# Altium project LM2596_DC-DC.PrjPcb
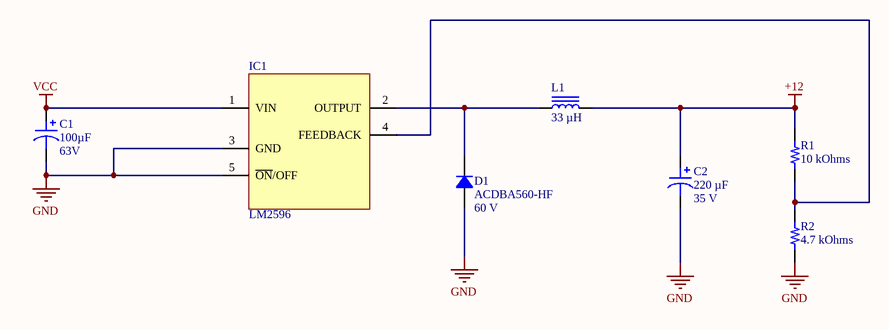
[diagram p0: LM2596SCH.SchDoc]
1 sheet, 7 parts. Net scope: global (net labels, ports and power ports of the same name join across sheets).
Board file: lm2596.PcbDoc

## Sheet LM2596SCH.SchDoc
size A2; SheetNumber: 1; SheetTotal: 1

### Parts
C1  100µF  Voltage - Rated: 63V  [CAP TH ALUM ELEC D8.00mm S3.50mm H12.50mm]
C2  220 µF  Voltage - Rated: 35 V  [CAP AL TH D8 L3.5 H12.5]
D1  ACDBA560-HF  Voltage - DC Reverse (Vr) (Max): 60 V  [DO214AC SMA]
IC1  LM2596  [LM2596]
L1  33 µH  [BOURNS SRR1280]
R1  10 kOhms  [RES 0805_2012]
R2  4.7 kOhms  [RES 0805_2012]

### Nets
+12: C2.1 L1.2 R1.2
GND: C1.2 C2.2 D1.1 IC1.3(GND) IC1.5(~{ON}/OFF) R2.1
VCC: C1.1 IC1.1(VIN)
NetD1_2: D1.2 IC1.2(OUTPUT) L1.1
NetIC1_4: IC1.4(FEEDBACK) R1.1 R2.2

### Library data of the parts
C1 = ECA-1JM101: CAP ALUM 100UF 20% 63V RADIAL; manufacturer: Panasonic Electronic Components; Lifetime @ Temp.: 2000 Hrs @ 85°C; Polarization: Polar; Ripple Current @ High Frequency: 459mA @ 10kHz; Ripple Current @ Low Frequency: 270mA @ 120Hz; Part Number: ECA-1JM101; Applications: General Purpose; Capacitance: 100µF; componentlink1description: Datasheet; componentlink1url: //media.digikey.com/pdf/Data%20Sheets/Panasonic%20Electronic%20Components/ECA-xxM%20Series,TypeA.pdf; componentlink2description: DigiKey Link; componentlink2url: http://digikey.com/product-detail/en/panasonic-electronic-components/ECA-1JM101/P5193-ND/245052; Device Package: Radial, Can; Height - Seated (Max): 0.492" (12.50mm); lastupdated: 7.09.2020 05:24:51; Lead Spacing: 0.138" (3.50mm); Lifecycle Status: Active; Minimum Order: 1; Mounting Type: Through Hole; Operating Temperature: -40°C ~ 85°C; Package / Case: Radial, Can; packaging: Bulk; partid: 7225; Part Status: Active; price: 0.37; series: M; Size / Dimension: 0.315" Dia (8.00mm); Supplier 1: DigiKey; Supplier Part Number 1: P5193-ND; Tolerance: ±20%; value: 100µF
C2 = ECA-1VM221: CAP ALUM 220UF 20% 35V RADIAL; manufacturer: Panasonic Electronic Components; Lifetime @ Temp.: 2000 Hrs @ 85°C; Polarization: Polar; Ripple Current @ High Frequency: 595 mA @ 10 kHz; Ripple Current @ Low Frequency: 350 mA @ 120 Hz; Part Number: ECA-1VM221; Applications: General Purpose; Capacitance: 220 µF; componentlink1description: Datasheet; componentlink1url: //media.digikey.com/pdf/Data%20Sheets/Panasonic%20Electronic%20Components/ECA-xxM%20Series,TypeA.pdf; componentlink2description: DigiKey Link; componentlink2url: https://www.digikey.com/en/products/detail/panasonic-electronic-components/ECA-1VM221/245025; Device Package: Radial, Can; Height - Seated (Max): 0.492" (12.50mm); lastupdated: 23.05.2022 13:42:17; Lead Spacing: 0.138" (3.50mm); Lifecycle Status: Active; Minimum Order: 1; Mounting Type: Through Hole; Operating Temperature: -40°C ~ 85°C; Package / Case: Radial, Can; packaging: Bulk; partid: 7280; Part Status: Active; price: 0.10; series: M-A; Size / Dimension: 0.315" Dia (8.00mm); Supplier 1: DigiKey; Supplier Part Number 1: P5166-ND; Tolerance: ±20%; value: 220 µF
D1 = ACDBA560-HF: DIODE SCHOTTKY 60V 5A DO214AC; Manufacturer: Comchip Technology; Capacitance @ Vr, F: 250pF @ 4V, 1MHz; Current - Average Rectified (Io): 5A (DC); Current - Reverse Leakage @ Vr: 500 µA @ 60 V; Speed: Fast Recovery =< 500ns, > 200mA (Io); Voltage - Forward (Vf) (Max) @ If: 700 mV @ 5 A; Part Number: ACDBA560-HF; ComponentLink1Description: Datasheet; ComponentLink1URL: http://www.comchiptech.com/admin/files/product/ACDBA560-HF%20RevA201382.pdf; ComponentLink2Description: DigiKey Link; ComponentLink2URL: https://www.digikey.com/en/products/detail/comchip-technology/ACDBA560-HF/7100903; Diode Type: Schottky; LastUpdated: 23.05.2022 13:36:13; Lifecycle Status: Active; Minimum Order: 1; Mounting Type: Surface Mount; Operating Temperature - Junction: -55°C ~ 125°C; Package / Case: DO-214AC, SMA; Packaging: TapeAndReel; PartId: 1832; Part Status: Active; Price: 0.15; Series: Automotive, AEC-Q101; Supplier 1: DigiKey; Supplier Part Number 1: 641-2078-1-ND; Supplier Device Package: DO-214AC (SMA)
L1 = SRR1280-330M: FIXED IND 33UH 3.5A 57 MOHM SMD; Manufacturer: Bourns Inc.; Current - Saturation: 3.3A; DC Resistance (DCR): 57mOhm Max; Frequency - Self Resonant: 9.5MHz; Inductance Frequency - Test: 100 kHz; Material - Core: Ferrite; Q @ Freq: 28 @ 2.52MHz; Shielding: Shielded; Tolerance: ±20%; Type: Wirewound; Part Number: SRR1280-330M; ComponentLink1Description: Datasheet; ComponentLink1URL: https://www.bourns.com/docs/Product-Datasheets/SRR1280.pdf; ComponentLink2Description: DigiKey Link; ComponentLink2URL: https://www.digikey.com/en/products/detail/bourns-inc/SRR1280-330M/1969998; Current Rating (Amps): 3.5 A; Device Package: Nonstandard; Height - Seated (Max): 0.315" (8.00mm); Inductance: 33 µH; LastUpdated: 23.05.2022 13:40:12; Lifecycle Status: Active; Minimum Order: 1; Mounting Type: Surface Mount; Operating Temperature: -40°C ~ 125°C; Package / Case: Nonstandard; Packaging: TapeAndReel; PartId: 25; Part Status: Active; Price: 0.82; Series: SRR1280; Size / Dimension: 0.492" L x 0.492" W (12.50mm x 12.50mm); Supplier 1: DigiKey; Supplier Part Number 1: SRR1280-330MCT-ND; Value: 33 µH
R1 = RNCS0805BKE10K0: RES 10K OHM 0.1% 1/10W 0805; Manufacturer: Stackpole Electronics Inc; Power (Watts): 0.1W, 1/10W; Temperature Coefficient: ±25ppm/°C; Part Number: RNCS0805BKE10K0; Value: 10 kOhms; ComponentLink1Description: Datasheet; ComponentLink1URL: https://www.seielect.com/catalog/sei-rncs_rnch.pdf; ComponentLink2Description: DigiKey Link; ComponentLink2URL: https://www.digikey.com/en/products/detail/stackpole-electronics-inc/RNCS0805BKE10K0/1800067; Composition: Thin Film; Device Package: 0805 (2012 Metric); Features: Anti-Corrosive, Automotive AEC-Q200, Moisture Resistant; Height - Seated (Max): 0.026" (0.65mm); LastUpdated: 23.05.2022 13:28:13; Lifecycle Status: Active; Minimum Order: 1; Number of Terminations: 2; Operating Temperature: -55°C ~ 155°C; Package / Case: 0805 (2012 Metric); Packaging: TapeAndReel; PartId: 27713; Part Status: Active; Price: 0.09; Ratings: AEC-Q200; Resistance: 10 kOhms; Series: RNCS; Size / Dimension: 0.079" L x 0.049" W (2.00mm x 1.25mm); Supplier 1: DigiKey; Supplier Part Number 1: RNCS0805BKE10K0CT-ND; Supplier Device Package: 0805; Tolerance: ±0.1%
R2 = CRGP0805F4K7: RES 4.7K OHM 1% 1/3W 0805; Manufacturer: TE Connectivity Passive Product; Power (Watts): 0.333W, 1/3W; Temperature Coefficient: ±100ppm/°C; Part Number: CRGP0805F4K7; Value: 4.7 kOhms; ComponentLink1Description: Datasheet; ComponentLink1URL: https://www.te.com/commerce/DocumentDelivery/DDEController?Action=srchrtrv&DocNm=9-1773463-9&DocType=DS&DocLang=English; ComponentLink2Description: DigiKey Link; ComponentLink2URL: https://www.digikey.com/en/products/detail/te-connectivity-passive-product/CRGP0805F4K7/8577087; Composition: Thick Film; Device Package: 0805 (2012 Metric); Features: Pulse Withstanding; Height - Seated (Max): 0.026" (0.65mm); LastUpdated: 23.05.2022 13:28:09; Lifecycle Status: Active; Minimum Order: 1; Number of Terminations: 2; Operating Temperature: -55°C ~ 155°C; Package / Case: 0805 (2012 Metric); Packaging: TapeAndReel; PartId: 28726; Part Status: Active; Price: 0.02; Resistance: 4.7 kOhms; Series: CRGP; Size / Dimension: 0.079" L x 0.049" W (2.00mm x 1.25mm); Supplier 1: DigiKey; Supplier Part Number 1: A130485CT-ND; Supplier Device Package: 0805; Tolerance: ±1%